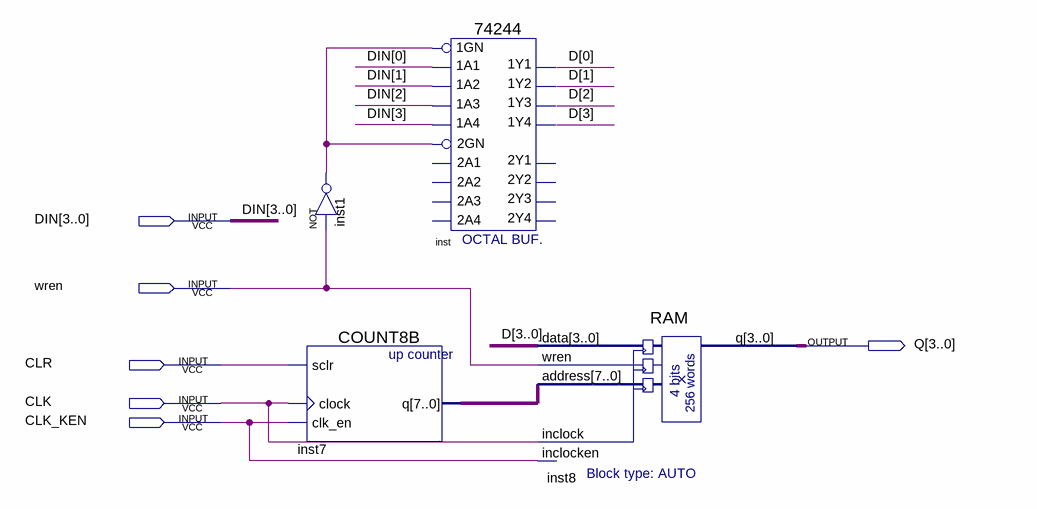
[diagram p0: schematic sheet]
// Quartus schematic PRAM.bdf as structural Verilog: 4 symbols, 6 pins
module PRAM (
  input  [3:0] DIN,
  input  wren,
  input  CLR,
  input  CLK,
  input  CLK_KEN,
  output [3:0] Q
);

  wire inst1_out;
  wire [3:0] D;
  wire [7:0] inst7_q;

  not inst1 (inst1_out, wren);
  COUNT8B inst7 (.sclr(CLR), .clock(CLK), .clk_en(CLK_KEN), .q(inst7_q));
  \74244  inst (
    .\1A2 (DIN[1]), .\1A4 (DIN[3]), .\1A1 (DIN[0]), .\1A3 (DIN[2]), .\1GN (inst1_out), .\2GN (inst1_out),
    .\1Y2 (D[1]), .\1Y4 (D[3]), .\1Y1 (D[0]), .\1Y3 (D[2]));  // open: 2A3, 2A1, 2A4, 2A2, 2Y1, 2Y3, 2Y4, 2Y2
  RAM inst8 (.data(D), .wren(wren), .address(inst7_q), .inclock(CLK), .inclocken(CLK_KEN), .q(Q));
endmodule
